# Altium schematic sheet ADC.SchDoc: ThunderScope 1000E
size A4; DrawnBy: Aleksa Bjelogrlic; Revision: 1
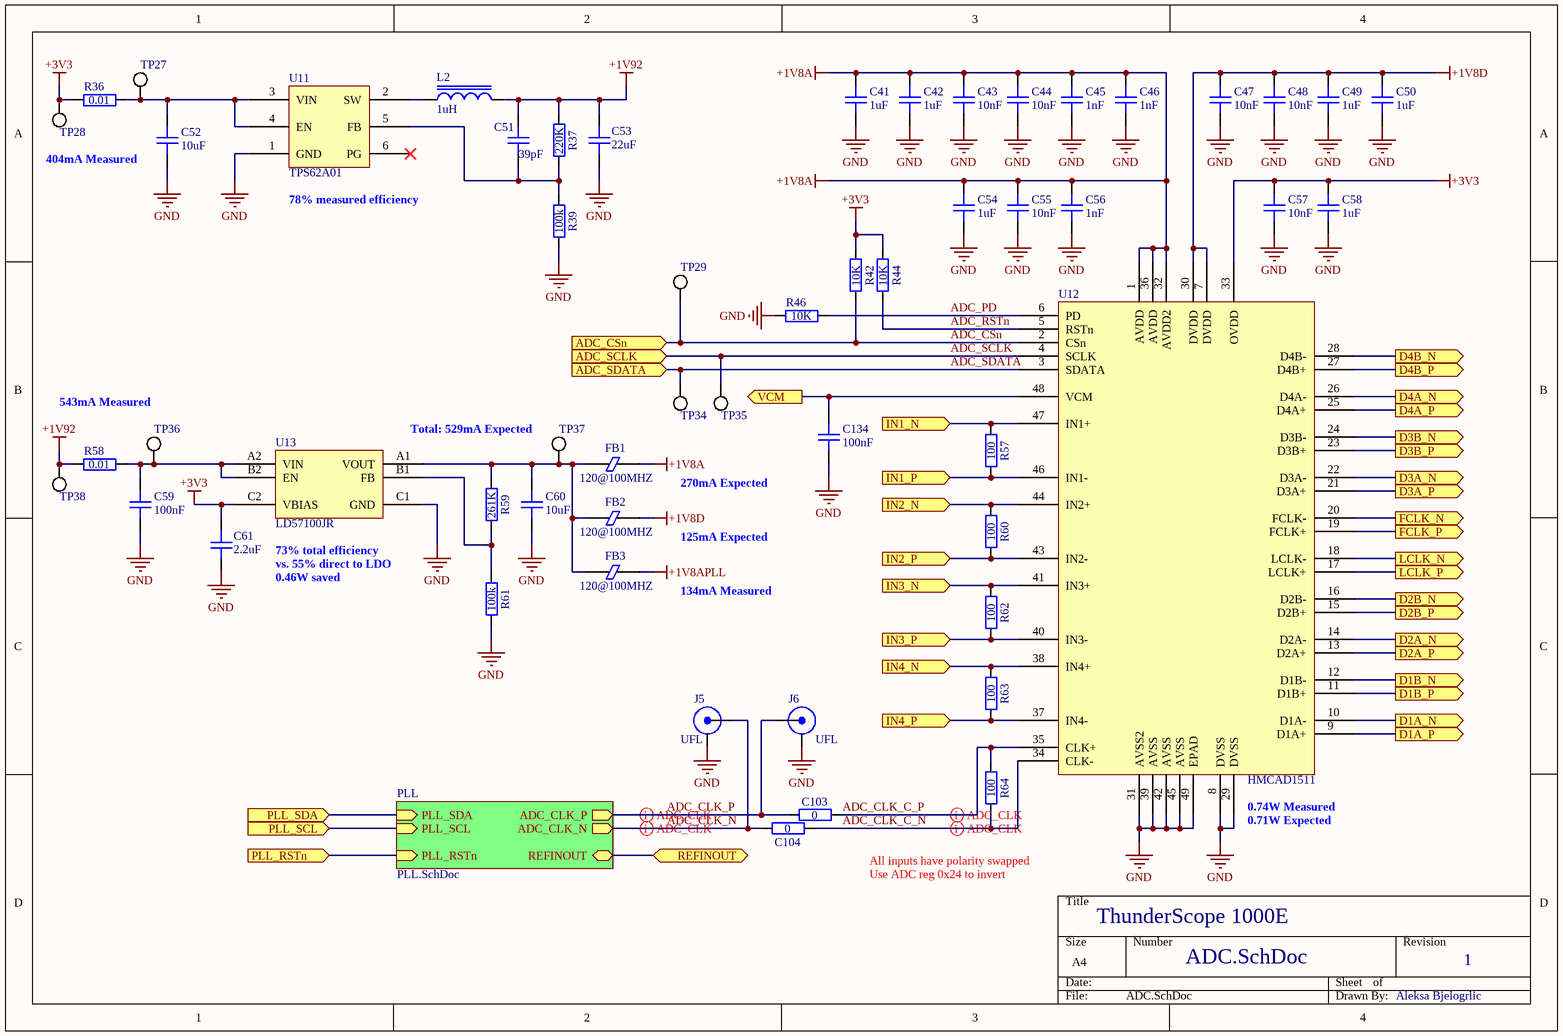
[diagram p0: ADC.SchDoc]

## Parts
C41  1uF  [GEN_C_0402]
C42  1uF  [GEN_C_0402]
C43  10nF  [GEN_C_0402]
C44  10nF  [GEN_C_0402]
C45  1nF  [GEN_C_0402]
C46  1nF  [GEN_C_0402]
C47  10nF  [GEN_C_0402]
C48  10nF  [GEN_C_0402]
C49  1uF  [GEN_C_0402]
C50  1uF  [GEN_C_0402]
C51  39pF  [GEN_C_0402]
C52  10uF  [GEN_C_0603]
C53  22uF  [GEN_C_0805]
C54  1uF  [GEN_C_0402]
C55  10nF  [GEN_C_0402]
C56  1nF  [GEN_C_0402]
C57  10nF  [GEN_C_0402]
C58  1uF  [GEN_C_0402]
C59  100nF  [GEN_C_0402]
C60  10uF  [GEN_C_0603]
C61  2.2uF  [GEN_C_0402]
C103  0  [GEN_R_0402]
C104  0  [GEN_R_0402]
C134  100nF  [GEN_C_0402]
FB1  120@100MHZ  [GEN_R_0402]
FB2  120@100MHZ  [GEN_R_0402]
FB3  120@100MHZ  [GEN_R_0402]
J5  UFL  [TE_2334884-1]
J6  UFL  [TE_2334884-1]
L2  1uH  [GEN_L_1210]
R36  0.01  [GEN_R_0603]
R37  220K  [GEN_R_0402]
R39  100k  [GEN_R_0402]
R42  10K  [GEN_R_0402]
R44  10K  [GEN_R_0402]
R46  10K  [GEN_R_0402]
R57  100  [GEN_R_0402]
R58  0.01  [GEN_R_0603]
R59  261K  [GEN_R_0402]
R60  100  [GEN_R_0402]
R61  100k  [GEN_R_0402]
R62  100  [GEN_R_0402]
R63  100  [GEN_R_0402]
R64  100  [GEN_R_0402]
TP27  PCB  [GEN_TP_PCB]  (value not drawn)  (no BOM)
TP28  PCB  [GEN_TP_PCB]  (value not drawn)  (no BOM)
TP29  PCB  [GEN_TP_PCB]  (value not drawn)  (no BOM)
TP34  PCB  [GEN_TP_PCB]  (value not drawn)  (no BOM)
TP35  PCB  [GEN_TP_PCB]  (value not drawn)  (no BOM)
TP36  PCB  [GEN_TP_PCB]  (value not drawn)  (no BOM)
TP37  PCB  [GEN_TP_PCB]  (value not drawn)  (no BOM)
TP38  PCB  [GEN_TP_PCB]  (value not drawn)  (no BOM)
U11  TPS62A01  [TI_SOT563_DRL0006A]
U12  HMCAD1511  [AD_QFN48_LP7]
U13  LD57100JR  [ST_FlipChip6]

## Sub-sheets
PLL = PLL.SchDoc: ADC_CLK_P (out), ADC_CLK_N (out), PLL_RSTn (in), PLL_SDA (in), PLL_SCL (in), REFINOUT (bidir)

## Ports
ADC_CSn (in), ADC_SCLK (in), ADC_SDATA (in), D1A_N (out), D1A_P (out), D1B_N (out), D1B_P (out), D2A_N (out), D2A_P (out), D2B_N (out), D2B_P (out), D3A_N (out), D3A_P (out), D3B_N (out), D3B_P (out), D4A_N (out), D4A_P (out), D4B_N (out), D4B_P (out), FCLK_N (out), FCLK_P (out), IN1_N (in), IN1_P (in), IN2_N (in), IN2_P (in), IN3_N (in), IN3_P (in), IN4_N (in), IN4_P (in), LCLK_N (out), LCLK_P (out), PLL_RSTn (in), PLL_SCL (in), PLL_SDA (in), REFINOUT (bidir), VCM (out)

## Nets
+1V8A: C41.2 C42.2 C43.2 C44.2 C45.2 C46.2 C54.2 C55.2 C56.2 FB1.2 U12.1(AVDD) U12.32(AVDD2) U12.36(AVDD)
+1V8APLL: FB3.2
+1V8D: C47.2 C48.2 C49.2 C50.2 FB2.2 U12.7(DVDD) U12.30(DVDD)
+1V92: C51.2 C53.2 L2.2 R37.2 R58.1 TP38.1
+3V3: C57.2 C58.2 C61.2 R36.1 R42.2 R44.2 TP28.1 U12.33(OVDD) U13.C2(VBIAS)
GND: C41.1 C42.1 C43.1 C44.1 C45.1 C46.1 C47.1 C48.1 C49.1 C50.1 C52.1 C53.1 C54.1 C55.1 C56.1 C57.1 C58.1 C59.1 C60.1 C61.1 C134.1 J5.2(SHIELD) J6.2(SHIELD) R39.1 R46.2 R61.1 U11.1(GND) U12.8(DVSS) U12.29(DVSS) U12.31(AVSS2) U12.39(AVSS) U12.42(AVSS) U12.45(AVSS) U12.49(EPAD) U13.C1(GND)
ADC_CLK_C_N: C104.1 R64.1 U12.34(CLK-)
ADC_CLK_C_P: C103.1 R64.2 U12.35(CLK+)
ADC_CLK_N: C104.2 J5.1(Signal) ; sheet PLL/ADC_CLK_N
ADC_CLK_P: C103.2 J6.1(Signal) ; sheet PLL/ADC_CLK_P
ADC_CSn: R42.1 TP29.1 U12.2(CSn) ; port ADC_CSn
ADC_PD: R46.1 U12.6(PD)
ADC_RSTn: R44.1 U12.5(RSTn)
ADC_SCLK: TP35.1 U12.4(SCLK) ; port ADC_SCLK
ADC_SDATA: TP34.1 U12.3(SDATA) ; port ADC_SDATA
D1A_N: U12.10(D1A-) ; port D1A_N
D1A_P: U12.9(D1A+) ; port D1A_P
D1B_N: U12.12(D1B-) ; port D1B_N
D1B_P: U12.11(D1B+) ; port D1B_P
D2A_N: U12.14(D2A-) ; port D2A_N
D2A_P: U12.13(D2A+) ; port D2A_P
D2B_N: U12.16(D2B-) ; port D2B_N
D2B_P: U12.15(D2B+) ; port D2B_P
D3A_N: U12.22(D3A-) ; port D3A_N
D3A_P: U12.21(D3A+) ; port D3A_P
D3B_N: U12.24(D3B-) ; port D3B_N
D3B_P: U12.23(D3B+) ; port D3B_P
D4A_N: U12.26(D4A-) ; port D4A_N
D4A_P: U12.25(D4A+) ; port D4A_P
D4B_N: U12.28(D4B-) ; port D4B_N
D4B_P: U12.27(D4B+) ; port D4B_P
FCLK_N: U12.20(FCLK-) ; port FCLK_N
FCLK_P: U12.19(FCLK+) ; port FCLK_P
IN1_N: R57.2 U12.47(IN1+) ; port IN1_N
IN1_P: R57.1 U12.46(IN1-) ; port IN1_P
IN2_N: R60.2 U12.44(IN2+) ; port IN2_N
IN2_P: R60.1 U12.43(IN2-) ; port IN2_P
IN3_N: R62.2 U12.41(IN3+) ; port IN3_N
IN3_P: R62.1 U12.40(IN3-) ; port IN3_P
IN4_N: R63.2 U12.38(IN4+) ; port IN4_N
IN4_P: R63.1 U12.37(IN4-) ; port IN4_P
LCLK_N: U12.18(LCLK-) ; port LCLK_N
LCLK_P: U12.17(LCLK+) ; port LCLK_P
PLL_RSTn: port PLL_RSTn, sheet PLL/PLL_RSTn
PLL_SCL: port PLL_SCL, sheet PLL/PLL_SCL
PLL_SDA: port PLL_SDA, sheet PLL/PLL_SDA
REFINOUT: port REFINOUT, sheet PLL/REFINOUT
VCM: C134.2 U12.48(VCM) ; port VCM
NetC51_1: C51.1 R37.1 R39.2 U11.5(FB)
NetC52_2: C52.2 R36.2 TP27.1 U11.3(VIN) U11.4(EN)
NetC59_2: C59.2 R58.2 TP36.1 U13.A2(VIN) U13.B2(EN)
NetC60_2: C60.2 FB1.1 FB2.1 FB3.1 R59.2 TP37.1 U13.A1(VOUT)
NetL2_1: L2.1 U11.2(SW)
NetR59_1: R59.1 R61.2 U13.B1(FB)

Not connected (* = marked no-connect by the designer): U11 6(PG)*

## Layout directives
differential pair: ADC_CLK_C_N, ADC_CLK_C_P, ADC_CLK_N, ADC_CLK_P

## Notes on the sheet
- 404mA Measured
- (near U11) 78% measured efficiency
- 543mA Measured
- Total: 529mA Expected
- 270mA Expected
- 73% total efficiency
- vs. 55% direct to LDO
- 0.46W saved
- 125mA Expected
- 134mA Measured
- (near U12) 0.74W Measured
- (near U12) 0.71W Expected
- All inputs have polarity swapped
- Use ADC reg 0x24 to invert
- Aleksa Bjelogrlic

## Library data of the parts
C41 C42 C49 C50 C54 C58 = CAP 1uF 25V X5R 0402: Voltage Rating: 25V; Package: 0402; Supplier 1: Digi-Key; Supplier Part Number 1: 490-10017-1-ND; Value: 1uF
C43 C44 C47 C48 C55 C57 = CAP 10nF 50V X7R 0402: Voltage Rating: 50V; Package: 0402; Supplier 1: Digi-Key; Supplier Part Number 1: 490-6351-1-ND; Value: 10nF
C45 C46 C56 = CAP 1nF 50V C0G 0402: Voltage Rating: 50V; Package: 0402; Supplier 1: Digi-Key; Supplier Part Number 1: 490-6189-1-ND; Value: 1nF
C51 = CAP 39pF 50V C0G 0402: Temperature Coefficient: C0G; Voltage Rating: 50V; Package: 0402; Value: 39pF; Supplier 1: Digi-Key; Supplier Part Number 1: 399-C0402C390J5GAC7867CT-ND
C52 C60 = CAP 10uF 10V X5R 0603: Voltage Rating: 10V; Package: 0402; Supplier 1: Digi-Key; Supplier Part Number 1: 490-10474-1-ND; Value: 10uF
C53 = CAP 22uF 25V X5R 0805: Voltage Rating: 25V; Package: 0805; Value: 22uF; Supplier 1: Digi-Key; Supplier Part Number 1: 490-10749-1-ND
C59 C134 = CAP 100nF 16V X7R 0402: Voltage Rating: 16V; Package: 0402; Supplier 1: Digi-Key; Supplier Part Number 1: 490-4759-1-ND; Value: 100nF
C61 = CAP 2.2uF 10V X5R 0402: Voltage Rating: 10V; Package: 0402; Value: 2.2uF; Supplier 1: Digi-Key; Supplier Part Number 1: 587-3153-1-ND
C103 C104 = RES 0 OHM 1/16W 0402: Manufacturer: Yageo; Manufacturer Part Number: RC0402JR-070RL; Package: 0402; Supplier 1: Digi-Key; Supplier Part Number 1: 311-0.0JRCT-ND; Value: 0
FB1-FB3 = FERRITE BEAD 120 OHM 0402: Supplier 1: Digi-Key; Supplier Part Number 1: 490-9656-1-ND
J5 J6 = UFL Jack SMD: Supplier 1: Digi-Key; Supplier Part Number 1: A145155CT-ND
L2 = IND 1uH 3.1A 45 MOHM 1210: Value: 1uH; Supplier 1: Digi-Key; Supplier Part Number 1: 490-10590-1-ND
R36 R58 = RES 0.01 OHM 1% 1/4W 0603: Tolerance: 1%; Power Rating: 0.25W; Supplier 1: Digi-Key; Supplier Part Number 1: 408-1404-1-ND; Value: 0.01; Package: 0603
R37 = RES 220K OHM 1% 1/16W 0402: Tolerance: 1%; Power Rating: 0.0625W; Package: 0402; Value: 220K; Supplier 1: Digi-Key; Supplier Part Number 1: 311-220KLRCT-ND
R39 R61 = RES 100K OHM 1% 1/10W 0402: Tolerance: 1%; Power Rating: 0.1W; Package: 0402; Value: 100k; Supplier 1: Digi-Key; Supplier Part Number 1: 311-100KLRCT-ND
R42 R44 R46 = RES 10K OHM 1% 1/10W 0402: Tolerance: 1%; Power Rating: 0.1W; Package: 0402; Supplier 1: Digi-Key; Supplier Part Number 1: P10.0KLCT-ND; Value: 10K
R57 R60 R62-R64 = RES 100 OHM 1% 1/10W 0402: Tolerance: 1%; Power Rating: 0.1W; Package: 0402; Value: 100; Supplier 1: Digi-Key; Supplier Part Number 1: 2019-RK73H1ETTP1000FCT-ND
R59 = RES 261K OHM 1% 1/16W 0402: Tolerance: 1%; Power Rating: 0.0625W; Package: 0402; Value: 261K; Supplier 1: Digi-Key; Supplier Part Number 1: 311-261KLRCT-ND
TP27-TP29 TP34-TP38 = TP PCB 1mm
U11 = IC BUCK TPS62A01: Supplier 1: Mouser; Supplier Part Number 1: 595-TPS62A01DRLR
U12 = IC ADC HMCAD1511: Supplier 1: Digi-Key; Supplier Part Number 1: 1127-1648-ND
U13 = IC LDO LD57100JR: Supplier 1: Digi-Key; Supplier Part Number 1: 497-LD57100JRCT-ND